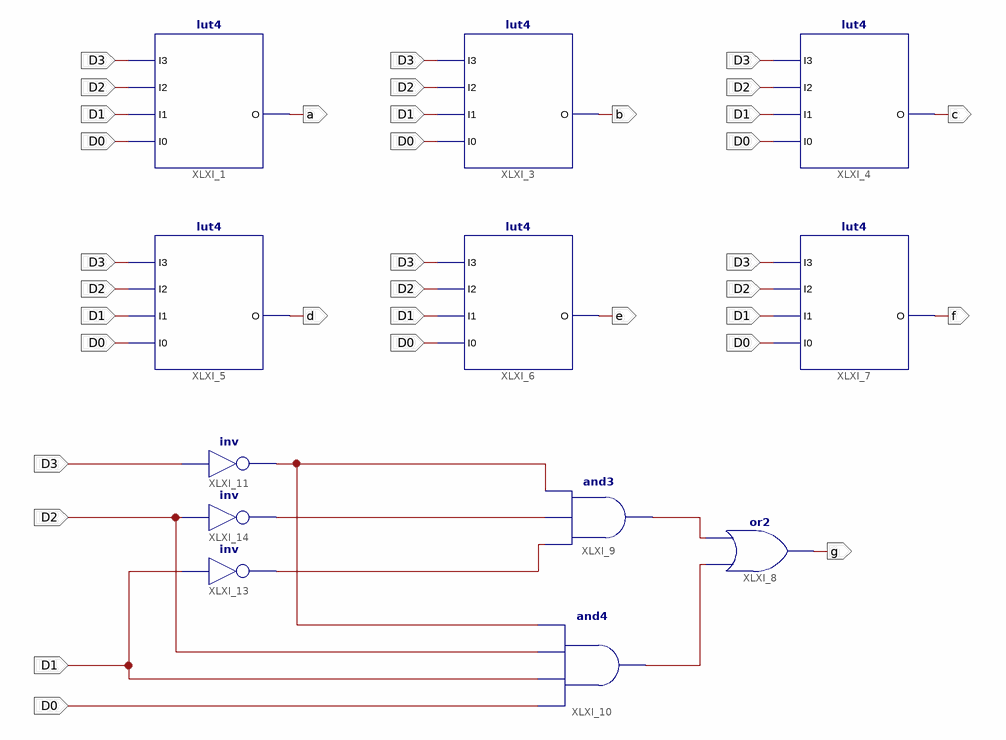
[diagram p0: schematic sheet 1]
// Xilinx ISE schematic Orner_Lab1_sseg_decoder.sch (spartan3e) as structural Verilog: 12 symbols, 11 ports
module Orner_Lab1_sseg_decoder (
  input  D3,
  input  D2,
  input  D1,
  input  D0,
  output a,
  output b,
  output c,
  output d,
  output e,
  output f,
  output g
);

  wire XLXN_32, XLXN_45, XLXN_46, XLXN_56, XLXN_67;

  lut4 #(.INIT("3812")) XLXI_1 (.I0(D0), .I1(D1), .I2(D2), .I3(D3), .O(a));
  lut4 #(.INIT("D860")) XLXI_3 (.I0(D0), .I1(D1), .I2(D2), .I3(D3), .O(b));
  lut4 #(.INIT("D004")) XLXI_4 (.I0(D0), .I1(D1), .I2(D2), .I3(D3), .O(c));
  lut4 #(.INIT("8692")) XLXI_5 (.I0(D0), .I1(D1), .I2(D2), .I3(D3), .O(d));
  lut4 #(.INIT("02BA")) XLXI_6 (.I0(D0), .I1(D1), .I2(D2), .I3(D3), .O(e));
  lut4 #(.INIT("308E")) XLXI_7 (.I0(D0), .I1(D1), .I2(D2), .I3(D3), .O(f));
  or XLXI_8 (g, XLXN_46, XLXN_45);
  and XLXI_9 (XLXN_45, XLXN_67, XLXN_56, XLXN_32);
  not XLXI_11 (XLXN_32, D3);
  not XLXI_13 (XLXN_67, D1);
  not XLXI_14 (XLXN_56, D2);
  and XLXI_10 (XLXN_46, D0, D1, D2, XLXN_32);
endmodule
